# EAGLE schematic mainpanel (EAGLE 8.6.0)
MOVE-ON Helium Sensor Board
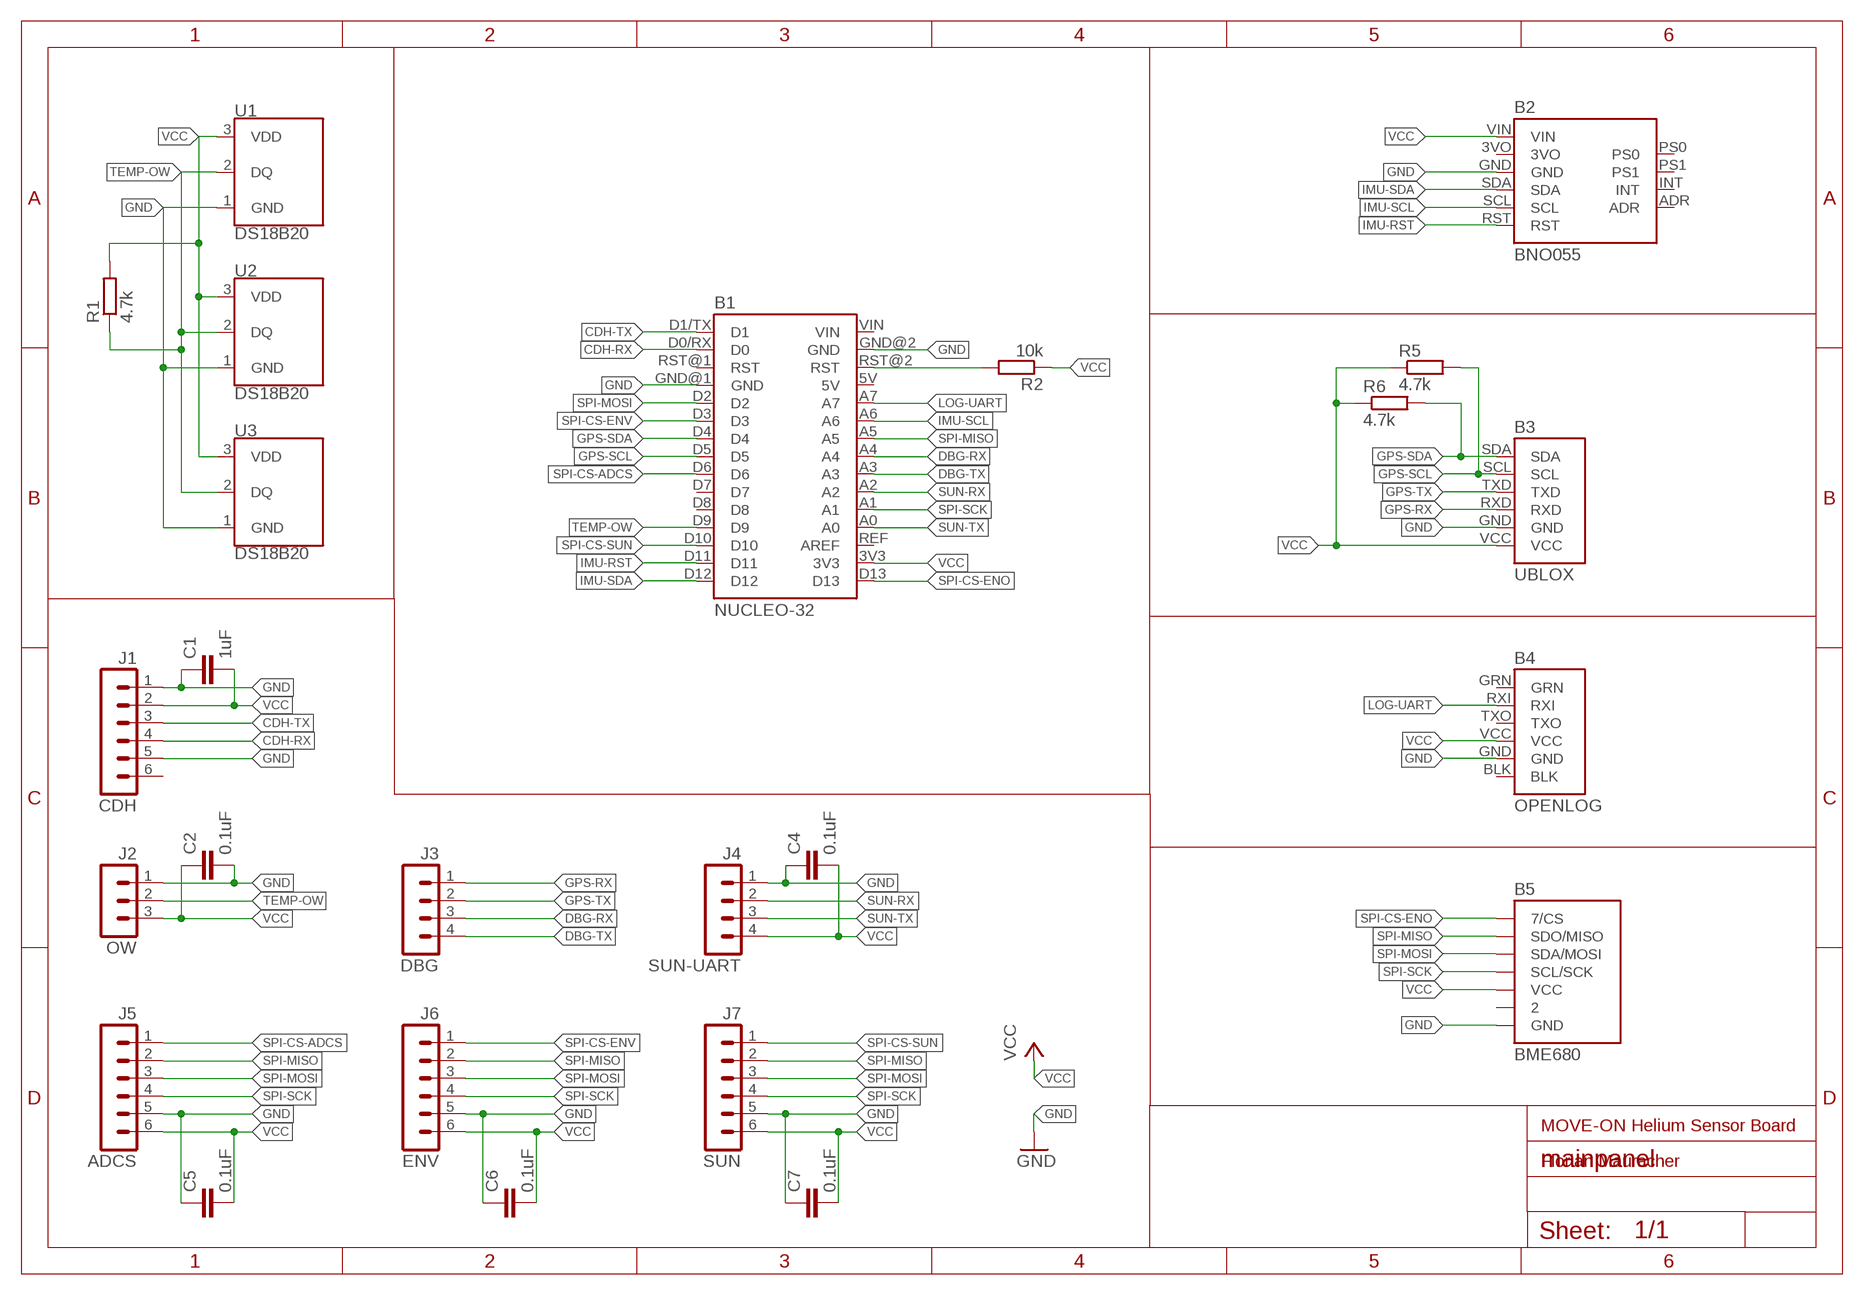
[diagram p0: schematic, sheet 1]

## Parts
B1  NUCLEO-32  NUCLEO-32BO  [NUCLEO-32]
B2  BNO055  BOSCH-BNO055BO  [BOSCH-BNO055]
B3  UBLOX  UPUTRONICS-UBLOX-PICOBO  [UPUTRONICS-UBLOX-PICO]
B4  OPENLOG  SPARKFUN-OPENLOGBO  [SPARKFUN-OPENLOG]
B5  BME680  WATTEROT-BME680BO  [WATTEROT-BME680]
C1  1uF  C-EUC2012  [C2012]
C2  0.1uF  C-EUC2012  [C2012]
C4  0.1uF  C-EUC2012  [C2012]
C5  0.1uF  C-EUC2012  [C2012]
C6  0.1uF  C-EUC2012  [C2012]
C7  0.1uF  C-EUC2012  [C2012]
J1  CDH  90136-106  [90136-1?06]
J2  OW  90136-103  [90136-1?03]
J3  DBG  90136-104  [90136-1?04]
J4  SUN-UART  90136-104  [90136-1?04]
J5  ADCS  90136-106  [90136-1?06]
J6  ENV  90136-106  [90136-1?06]
J7  SUN  90136-106  [90136-1?06]
R1  4.7k  R-EU_R2012  [R2012]
R2  10k  R-EU_R2012  [R2012]
R5  4.7k  R-EU_R2012  [R2012]
R6  4.7k  R-EU_R2012  [R2012]
U1  DS18B20  [TO-92-AMMO]
U2  DS18B20  [TO-92-AMMO]
U3  DS18B20  [TO-92-AMMO]

## Nets
CDH-RX: B1.D0/RX(D0) J1.4
CDH-TX: B1.D1/TX(D1) J1.3
DBG-RX: B1.A4 J3.3
DBG-TX: B1.A3 J3.4
GND: B1.GND@1(GND) B1.GND@2(GND) B2.GND B3.GND B4.GND B5.GND C1.1 C2.2 C4.1 C5.1 C6.1 C7.1 J1.1 J1.5 J2.1 J4.1 J5.5 J6.5 J7.5 U1.1(GND) U2.1(GND) U3.1(GND)
GPS-RX: B3.RXD J3.1
GPS-SCL: B1.D5 B3.SCL R5.2
GPS-SDA: B1.D4 B3.SDA R6.2
GPS-TX: B3.TXD J3.2
IMU-RST: B1.D11 B2.RST
IMU-SCL: B1.A6 B2.SCL
IMU-SDA: B1.D12 B2.SDA
LOG-UART: B1.A7 B4.RXI
NUC-RST: B1.RST@2(RST) R2.2
SPI-CS-ADCS: B1.D6 J5.1
SPI-CS-ENO: B1.D13 B5.CS(7/CS)
SPI-CS-ENV: B1.D3 J6.1
SPI-CS-SUN: B1.D10 J7.1
SPI-MISO: B1.A5 B5.SDO/MISO J5.2 J6.2 J7.2
SPI-MOSI: B1.D2 B5.SDA/MOSI J5.3 J6.3 J7.3
SPI-SCK: B1.A1 B5.SCL/SCK J5.4 J6.4 J7.4
SUN-RX: B1.A2 J4.2
SUN-TX: B1.A0 J4.3
TEMP-OW: B1.D9 J2.2 R1.1 U1.2(DQ) U2.2(DQ) U3.2(DQ)
VCC: B1.3V3 B2.VIN B3.VCC B4.VCC B5.VCC C1.2 C2.1 C4.2 C5.2 C6.2 C7.2 J1.2 J2.3 J4.4 J5.6 J6.6 J7.6 R1.2 R2.1 R5.1 R6.1 U1.3(VDD) U2.3(VDD) U3.3(VDD)
Unconnected: B1.D7 B1.D8 B1.REF(AREF) B1.RST@1(RST) B2.3VO B2.ADR B2.INT B2.PS0 B2.PS1 B4.BLK B4.TXO B5.2 J1.6

## Notes on the sheet
- MOVE-ON Helium Sensor Board
- Florian Mauracher

## Power pins joined to a net without a drawn wire
5V: B1.5V
GRN: B4.GRN
VIN: B1.VIN

## Library data of the parts
B1 = Frcy:NUCLEO-32: NUCLEO-L432KC http://www.st.com/en/evaluation-tools/nucleo-l432kc.html
B2 = Frcy:BOSCH-BNO055: Adafruit BNO055 https://www.adafruit.com/product/2472
B3 = Frcy:UPUTRONICS-UBLOX-PICO: uBLOX MAX-M8C Pico Breakout with Chip Antenna https://store.uputronics.com/index.php?route=product/product&path=60_64&product_id=72
B4 = Frcy:SPARKFUN-OPENLOG
B5 = Frcy:WATTEROT-BME680: Breakout Template
C1 C2 C4-C7 = rcl:C-EU: CAPACITOR, European symbol; SPICEPREFIX: C
J1 J5-J7 = con-molex-c-grid:90136-1?06: C-Grid III
J2 = con-molex-c-grid:90136-1?03: C-Grid III
J3 J4 = con-molex-c-grid:90136-1?04: C-Grid III
R1 R2 R5 R6 = rcl:R-EU_: RESISTOR, European symbol; SPICEPREFIX: R
U1-U3 = Frcy:DS18B20: Dallas/Maxim DS18B20 1-Wire Temperature Sensor The DS18B20 reports degrees C with 9 to 12-bit precision, -55C to 125C (+/-0.5C). Each sensor has a unique 64-Bit Serial number etched into it - allows for a huge number of sensors to be used on one data bus. Datasheet <http://datasheets.maximintegrated.com/en/ds/DS18B20.pdf> SparkFun Products One Wire Digital Temperature Sensor - DS18B20 <https://www.sparkfun.com/products/245> (SEN-00245); STORE_ID: SEN-00245

## Net classes
0 default: width 0.254 mm, drill 0.508 mm, clearance 0.203 mm